# EAGLE design drum (EAGLE 7.7.0)
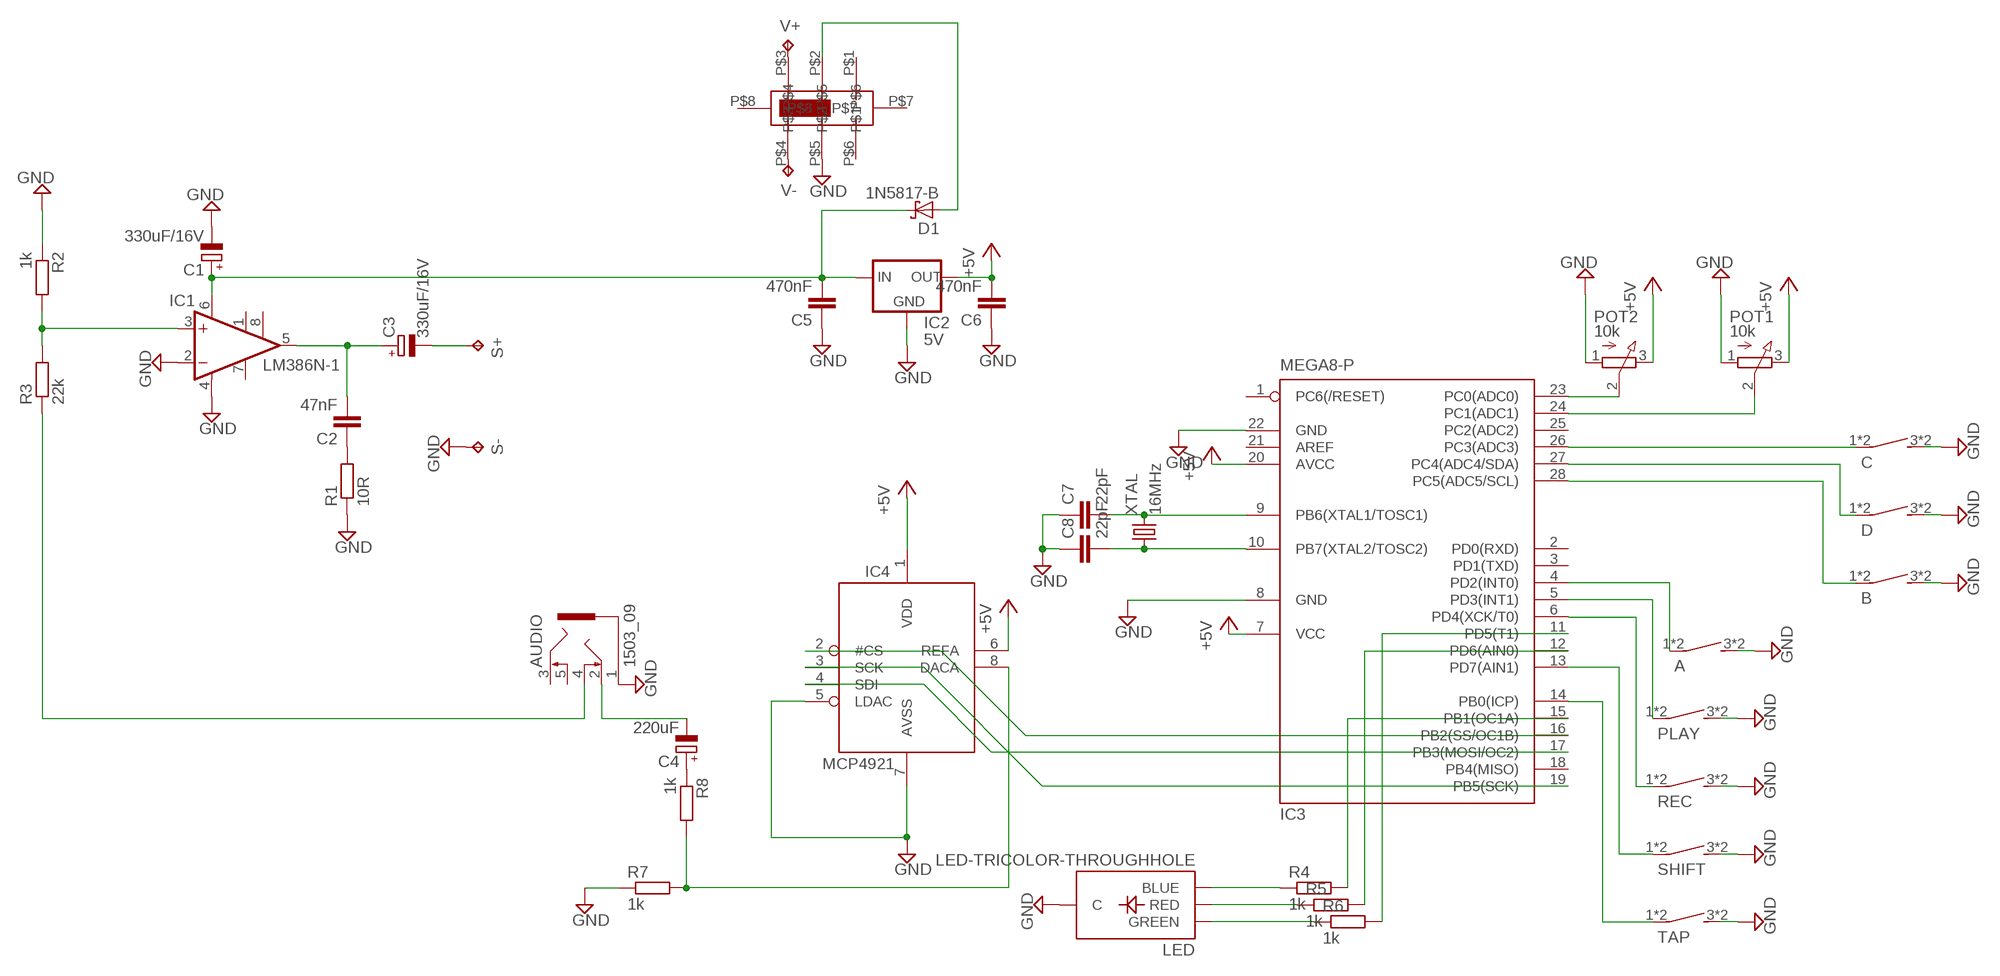
[diagram p0: schematic, sheet 1]

## Parts
A  D6R_SPSTB3F-4000  [B3F-4000]
AUDIO  1503_09  [1503_09]
B  D6R_SPSTB3F-4000  [B3F-4000]
C  D6R_SPSTB3F-4000  [B3F-4000]
C1  330uF/16V  CPOL-EUE3.5-8  [E3,5-8]
C2  47nF  C-EU050-024X044  [C050-024X044]
C3  330uF/16V  CPOL-EUE3.5-8  [E3,5-8]
C4  220uF  CPOL-EUE2.5-6  [E2,5-6]
C5  470nF  C-EU050-024X044  [C050-024X044]
C6  470nF  C-EU050-024X044  [C050-024X044]
C7  22pF  C-EU050-024X044  [C050-024X044]
C8  22pF  C-EU050-024X044  [C050-024X044]
D  D6R_SPSTB3F-4000  [B3F-4000]
D1  1N5817-B  [DO41-7.6]
IC1  LM386N-1  [DIL08]
IC2  5V  78LXX  [78LXX]
IC3  MEGA8-P  [DIL28-3]
IC4  MCP4921  [DIL08]
LED  LED-TRICOLOR-THROUGHHOLE  [LED-TRICOLOR-THROUGHHOLE]
PLAY  D6R_SPSTB3F-4000  [B3F-4000]
POT1  10k  RK09K11310KBF2J  [EVUFXJ]
POT2  10k  RK09K11310KBF2J  [EVUFXJ]
PWR  SLIDE_SW_DPDT  [SS008B02P22]
R1  10R  R-EU_0207/10  [0207/10]
R2  1k  R-EU_0207/10  [0207/10]
R3  22k  R-EU_0207/10  [0207/10]
R4  1k  R-EU_0207/10  [0207/10]
R5  1k  R-EU_0207/10  [0207/10]
R6  1k  R-EU_0207/10  [0207/10]
R7  1k  R-EU_0207/10  [0207/10]
R8  1k  R-EU_0207/10  [0207/10]
REC  D6R_SPSTB3F-4000  [B3F-4000]
S+  TPPAD1-17  [P1-17]
S-  TPPAD1-17  [P1-17]
SHIFT  D6R_SPSTB3F-4000  [B3F-4000]
TAP  D6R_SPSTB3F-4000  [B3F-4000]
V+  TPPAD1-17  [P1-17]
V-  TPPAD1-17  [P1-17]
XTAL  16MHz  CRYSTALHC49S  [HC49/S]

## Nets
+5V: C6.2 IC2.OUT IC3.7(VCC) IC3.20(AVCC) IC4.1(VDD) IC4.6(REFA) POT1.3(E) POT2.3(E)
GND: A.3(S) A.4(S) AUDIO.1 B.3(S) B.4(S) C1.- C5.1 C6.1 C7.1 C8.1 C.3(S) C.4(S) D.3(S) D.4(S) IC1.2(-IN) IC1.4(GND) IC2.GND IC3.8(GND) IC3.22(GND) IC4.5(LDAC) IC4.7(AVSS) LED.GND(C) PLAY.3(S) PLAY.4(S) POT1.1(A) POT2.1(A) PWR.P$5 R1.1 R2.1 R7.1 REC.3(S) REC.4(S) S-.TP SHIFT.3(S) SHIFT.4(S) TAP.3(S) TAP.4(S)
N$1: C2.1 R1.2
N$2: IC3.15(PB1(OC1A)) R4.2
N$3: IC3.12(PD6(AIN0)) R5.2
N$4: IC3.11(PD5(T1)) R6.2
N$5: IC3.5(PD3(INT1)) PLAY.1(P) PLAY.2(P)
N$6: C1.+ C5.2 D1.C IC1.6(VS) IC2.IN
N$7: IC3.17(PB3(MOSI/OC2)) IC4.4(SDI)
N$8: A.1(P) A.2(P) IC3.4(PD2(INT0))
N$9: IC3.19(PB5(SCK)) IC4.3(SCK)
N$10: IC3.23(PC0(ADC0)) POT2.2(S)
N$11: IC3.24(PC1(ADC1)) POT1.2(S)
N$12: C4.+ R8.1
N$13: IC4.8(DACA) R7.2 R8.2
N$14: LED.GRN(BLUE) R4.1
N$15: LED.BLU(RED) R5.1
N$16: LED.RED(GREEN) R6.1
N$17: C7.2 IC3.9(PB6(XTAL1/TOSC1)) XTAL.2
N$18: AUDIO.2 C4.-
N$19: D.1(P) D.2(P) IC3.27(PC4(ADC4/SDA))
N$20: C8.2 IC3.10(PB7(XTAL2/TOSC2)) XTAL.1
N$21: C2.2 C3.+ IC1.5(OUT)
N$22: C3.- S+.TP
N$23: IC1.3(+IN) R2.2 R3.2
N$24: AUDIO.4 R3.1
N$25: PWR.P$4 V-.TP
N$26: PWR.P$3 V+.TP
N$27: D1.A PWR.P$2
N$28: IC3.14(PB0(ICP)) TAP.1(P) TAP.2(P)
N$29: IC3.6(PD4(XCK/T0)) REC.1(P) REC.2(P)
N$31: IC3.13(PD7(AIN1)) SHIFT.1(P) SHIFT.2(P)
N$33: C.1(P) C.2(P) IC3.26(PC3(ADC3))
N$34: B.1(P) B.2(P) IC3.28(PC5(ADC5/SCL))
N$37: IC3.16(PB2(SS/OC1B)) IC4.2(#CS)
Unconnected: AUDIO.3 AUDIO.5 IC1.1(GAIN) IC1.7(BYPASS) IC1.8(GAIN) IC3.1(PC6(/RESET)) IC3.2(PD0(RXD)) IC3.3(PD1(TXD)) IC3.18(PB4(MISO)) IC3.21(AREF) IC3.25(PC2(ADC2)) PWR.P$1 PWR.P$6 PWR.P$7 PWR.P$8

## Library data of the parts
A B C D PLAY REC SHIFT TAP = adafruit:D6R_SPST: Judco 50-0015-00
AUDIO = con-lumberg:1503_09: Jack connectors according to JISC 6560, 3.5 mm Klinkeneinbaukupplung nach JISC 6560, 3,5 mm, 3-polig/ stereo, abgewinkelte Ausführung, mit 2 Öffnern und Lötaugen, für Leiterplatten Rückseitenmontage Source: http://www.lumberg.com/Produkte/PDFs/1503_09.pdf; OC_FARNELL: 1243244; OC_NEWARK: unknown
C1 C3 C4 = rcl:CPOL-EU: POLARIZED CAPACITOR, European symbol
C2 C5-C8 = resistor:C-EU: CAPACITOR, European symbol
D1 = diode:1N581*: 1.0A SCHOTTKY BARRIER RECTIFIER Source: http://www.diodes.com/datasheets/ds23001.pdf
IC1 = linear:LM386?-*: Low Voltage Audio Power Amplifier Source: http://cache.national.com/ds/LM/LM386.pdf
IC2 = v-reg:78LXX: VOLTAGE REGULATOR
IC3 = atmel:MEGA8-P: MICROCONTROLLER 8 Kbytes FLASH, 1 kbytes SRAM, 512 bytes EEPROM, USART, 4-channel 10 bit ADC, 2-channel 8 bit ADC Pin compatible with Atmega48, ATMega88, ATMega168 Source: avr.lbr; OC_FARNELL: unknown; OC_NEWARK: unknown
IC4 = adafruit:MCP4921
LED = SparkFun:LED-TRICOLOR-THROUGHHOLE
POT1 POT2 = blokas-labs:RK09K11310KB: 9 mm Square Rotary Potentiometers Source: Panasonic
PWR = blokas-labs:SLIDE_SW_DPDT
R1-R8 = resistor:R-EU_: RESISTOR, European symbol
S+ S- V+ V- = testpad:TP: Test pad
XTAL = crystal:CRYSTAL: CRYSTAL; OC_FARNELL: 1667008; OC_NEWARK: unknown

## Board
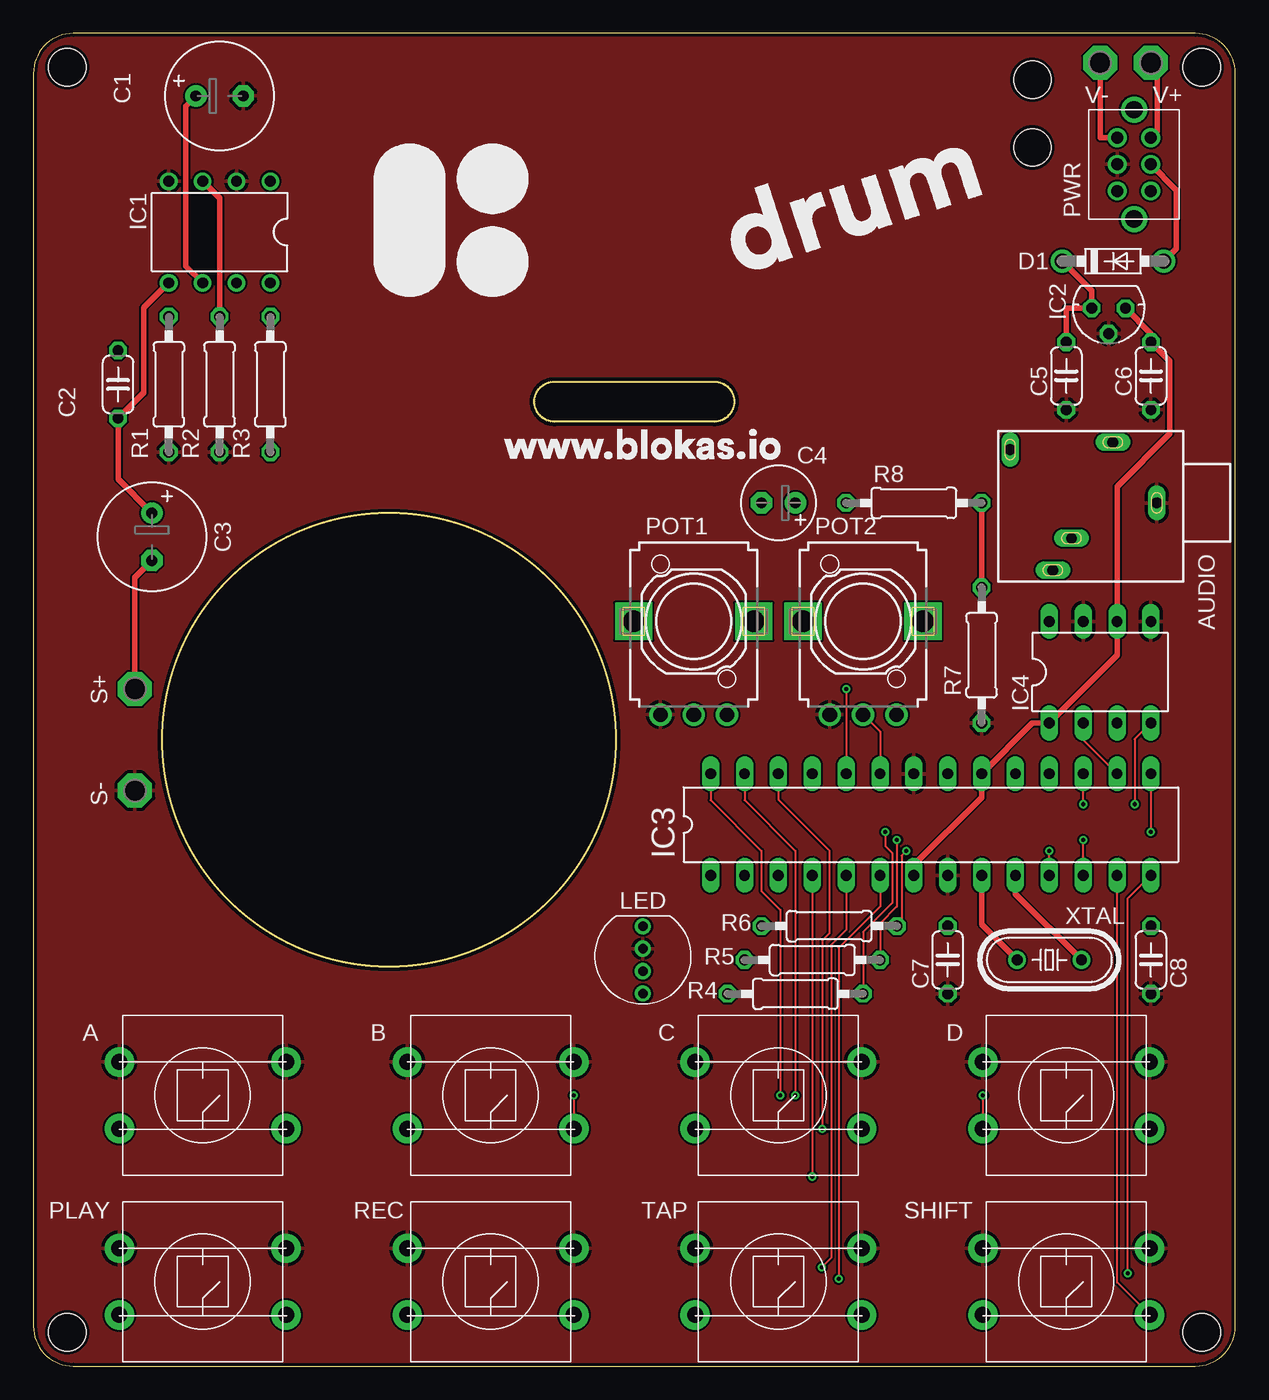
[diagram p1: board, top side]
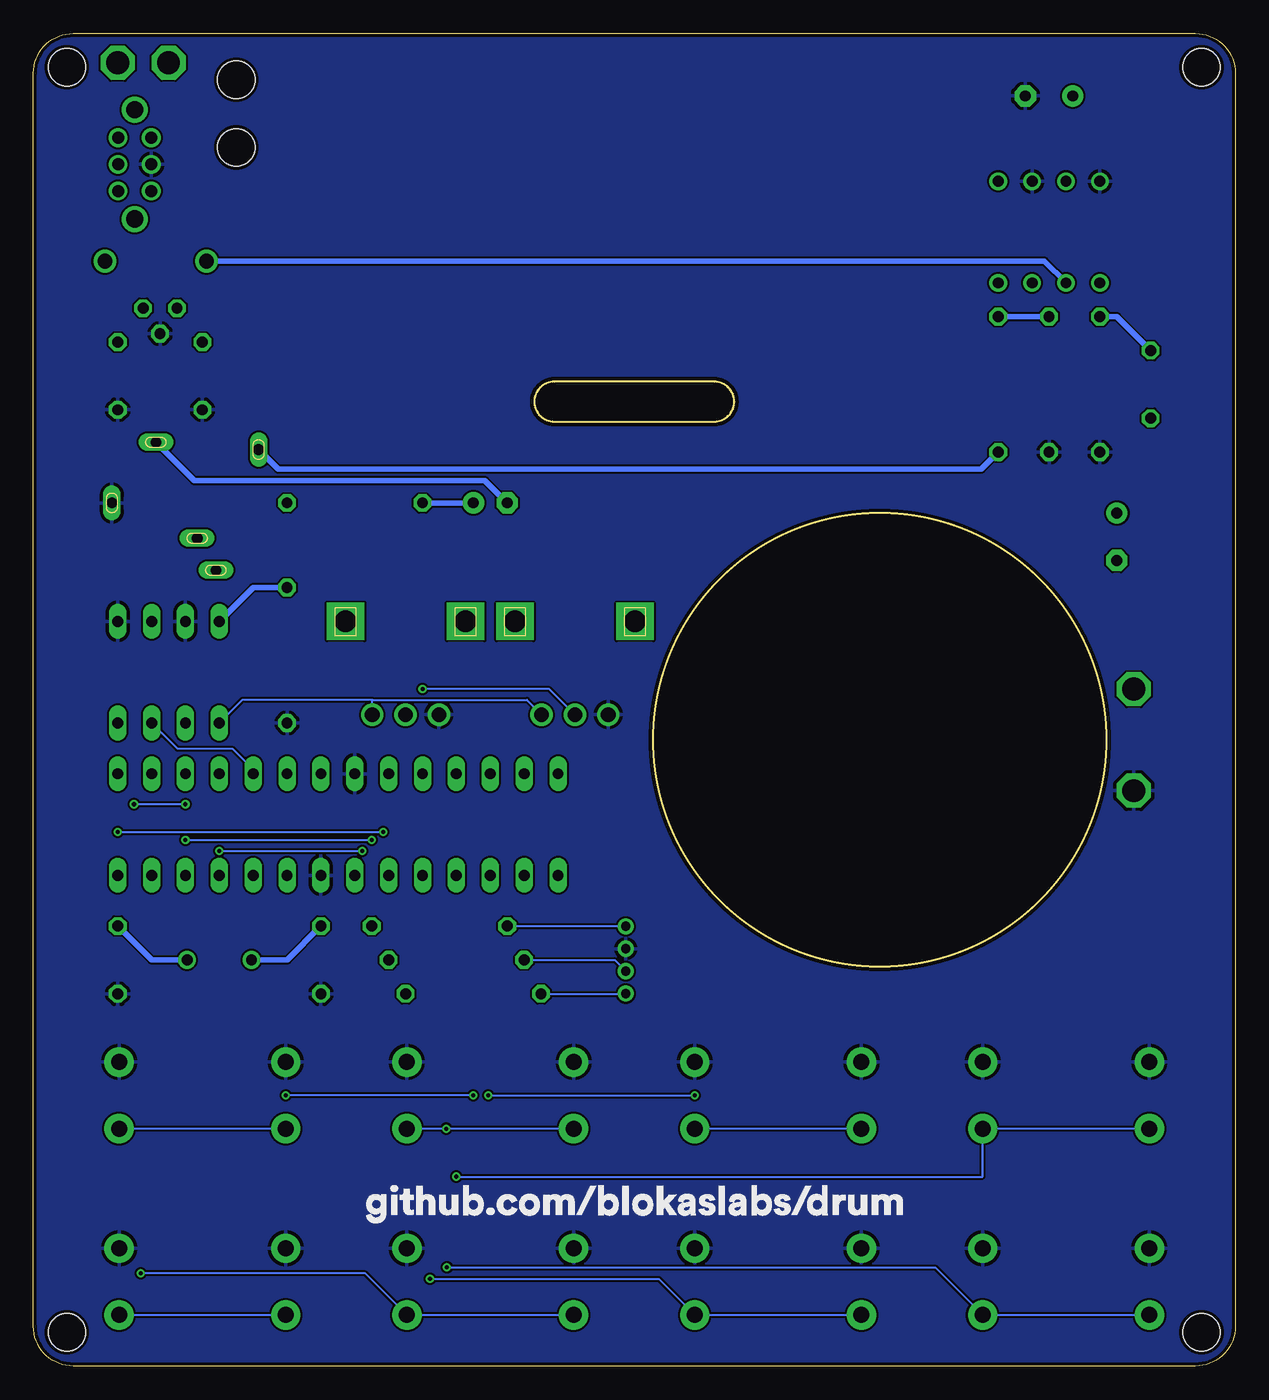
[diagram p2: board, bottom side, seen from below]

Size 90.15 x 100 mm. Coordinates in mm from the lower left corner, seen from the top.
Outline: 0,97 0,3 arc90 3,0 87.15,0 arc90 90.15,3 90.15,97 arc90 87.15,100 3,100 arc90 0,97
Outline: 51.08,70.86 39.08,70.86 arc-180 39.08,73.86 51.08,73.86 arc-180 51.08,70.86
Outline: circle at 26.67,46.99 radius 17
Copper layers (1*16): Top 0.035mm / dielectric 1.5mm / Bottom 0.035mm
Design rules "SeeedStudio_2layer_DRU_no_angle_20140221": minimum track width 6mil, minimum drill 12mil, track to track 6mil, track to pad 6mil, pad to pad 6mil, via to via 6mil, smd to smd 0mil, copper to edge 10mil, drill to drill 10mil, minimum pad ring 10mil, minimum via ring 6mil, stop-mask expansion 2mil, vias tented up to drill 100mil, thermal gap 10mil
Holes 2.8 mm at 2.54,2.54 87.63,2.54 2.54,97.46 87.63,97.46 74.93,96.52 74.93,91.44

### Footprints (pad centres in the part's own frame; a part is rotated, then mirrored left to right if it is on the bottom)
B3F-4000 = drill 1.2 pad 2.2: 1 6.25,-2.5; 2 -6.25,-2.5; 3 6.25,2.5; 4 -6.25,2.5
1503_09 = drill 0.8 pad 1.2 long: 1 0,-2.1; 2 -4.55,-5.4; 3 5.05,-9.9; 4 -4,-13.1; 5 2.65,-8.5
E3,5-8 = drill 0.813 pad 1.6: + -1.778,0 | drill 0.813 pad 1.6 octagon: - 1.778,0
C050-024X044 = drill 0.813 octagon: 1 -2.54,0; 2 2.54,0
E2,5-6 = drill 0.813 pad 1.6: + -1.27,0 | drill 0.813 pad 1.6 octagon: - 1.27,0
DO41-7.6 = drill 1.1 pad 1.7: A 3.81,0; C -3.81,0
DIL08 = drill 0.813 pad 1.27: 1 -3.81,-3.81; 2 -1.27,-3.81; 3 1.27,-3.81; 4 3.81,-3.81; 5 3.81,3.81; 6 1.27,3.81; 7 -1.27,3.81; 8 -3.81,3.81
78LXX = drill 0.813 octagon: GND 0,1.905; IN 1.27,0; OUT -1.27,0
DIL28-3 = drill 0.813 long: 1 -16.51,-3.81; 2 -13.97,-3.81; 3 -11.43,-3.81; 4 -8.89,-3.81; 5 -6.35,-3.81; 6 -3.81,-3.81; 7 -1.27,-3.81; 8 1.27,-3.81; 9 3.81,-3.81; 10 6.35,-3.81; 11 8.89,-3.81; 12 11.43,-3.81; 13 13.97,-3.81; 14 16.51,-3.81; 15 16.51,3.81; 16 13.97,3.81; 17 11.43,3.81; 18 8.89,3.81; 19 6.35,3.81; 20 3.81,3.81; 21 1.27,3.81; 22 -1.27,3.81; 23 -3.81,3.81; 24 -6.35,3.81; 25 -8.89,3.81; 26 -11.43,3.81; 27 -13.97,3.81; 28 -16.51,3.81
DIL08' = drill 0.813 long: 1 -3.81,-3.81; 2 -1.27,-3.81; 3 1.27,-3.81; 4 3.81,-3.81; 5 3.81,3.81; 6 1.27,3.81; 7 -1.27,3.81; 8 -3.81,3.81
LED-TRICOLOR-THROUGHHOLE = drill 0.7: BLU 0.841,0; GND -0.841,0; GRN 2.524,0; RED -2.524,0
EVUFXJ = drill 1.1 pad 1.676: 1 -2.5,-7; 2 0,-7; 3 2.5,-7 | drill 1.6 pad 2.8 square: M1 4.5,0; M2 -4.5,0
SS008B02P22 = drill 0.9: P$1 -2,-1.25; P$2 0,-1.25; P$3 2,-1.25; P$4 2,1.25; P$5 0,1.25; P$6 -2,1.25 | drill 1.3: P$7 -4.1,0; P$8 4.1,0
0207/10 = drill 0.813 octagon: 1 -5.08,0; 2 5.08,0
P1-17 = drill 1.702 pad 2.54 octagon: TP 0,0
HC49/S = drill 0.813: 1 -2.413,0; 2 2.413,0

### Placement (x,y rotation side)
A  12.7,20.32 0 top
AUDIO  86.36,64.77 270 top
B  34.29,20.32 0 top
C  55.88,20.32 0 top
C1  13.97,95.3 0 top
C2  6.35,73.66 270 top
C3  8.89,62.23 270 top
C4  55.88,64.77 180 top
C5  77.47,74.3 90 top
C6  83.82,74.3 90 top
C7  68.58,30.48 90 top
C8  83.82,30.48 90 top
D  77.47,20.32 0 top
D1  80.98,82.91 0 top
IC1  13.97,85.09 180 top
IC2  80.64,79.38 180 top
IC3  67.31,40.64 0 top
IC4  MCP4921  [DIL08']  80.01,52.07 0 top
LED  45.72,30.48 270 top
PLAY  12.7,6.35 0 top
POT1  49.53,55.88 0 top
POT2  62.23,55.88 0 top
PWR  82.55,90.17 90 top
R1  10.16,73.66 90 top
R2  13.97,73.66 90 top
R3  17.78,73.66 90 top
R4  57.15,27.94 0 top
R5  58.42,30.48 0 top
R6  59.69,33.02 0 top
R7  71.12,53.34 90 top
R8  66.04,64.77 0 top
REC  34.29,6.35 0 top
S+  7.62,50.8 0 top
S-  7.62,43.18 0 top
SHIFT  77.47,6.35 0 top
TAP  55.88,6.35 0 top
V+  83.82,97.79 0 top
V-  80.01,97.79 0 top
XTAL  76.2,30.48 180 top

### Tracks (layer width: path | path; a pad name or v marks a point on that pad's centre or on a via)
+5V
  Top 0.406: IC3.7 66.04,37.59 71.12,42.67 IC3.20 74.93,48.26 IC4.1 81.28,53.34 IC4.6 81.28,65.99 85.24,69.95 85.24,75.41 C6.2 83.82,77.47 IC2.OUT
  Bottom 0.152: POT2.3 64.73,49.99 | 64.73,49.99 53.14,49.99 POT1.3 | 64.73,49.99 74.47,49.99 IC4.1
GND
  pour Bottom: 0,97 0,3 arc90 3,0 87.15,0 arc90 90.15,3 90.15,97 arc90 87.15,100 3,100 arc90
  pour Top: 0,97 0,3 arc90 3,0 87.15,0 arc90 90.15,3 90.15,97 arc90 87.15,100 3,100 arc90
N$1
  Bottom 0.406: C2.1 8.89,78.74 R1.2
N$2  (via drill 0.3 pad 0.61)
  Top 0.152: IC3.15 v83.82,40.08 | v63.91,40.08 63.91,39.01 64.41,38.51 64.41,34.75 62.23,32.56 R4.2
  Bottom 0.152: v83.82,40.08 v63.91,40.08
N$3  (via drill 0.3 pad 0.61)
  Top 0.152: IC3.12 v78.74,39.47 | v64.77,39.47 64.77,34.49 63.5,33.22 R5.2
  Bottom 0.152: v78.74,39.47 v64.77,39.47
N$4  (via drill 0.3 pad 0.61)
  Top 0.152: IC3.11 v76.2,38.66 | v65.48,38.66 65.13,38.3 65.13,33.38 R6.2
  Bottom 0.152: v76.2,38.66 v65.48,38.66
N$5  (via drill 0.3 pad 0.61)
  Top 0.152: IC3.5 60.96,32.72 59.84,31.6 59.84,8.13 v59.13,7.42
  Bottom 0.152: PLAY.2 PLAY.1 22.52,7.42 v59.13,7.42
N$6
  Top 0.406: C1.+ 11.43,94.54 11.43,82.55 IC1.6 | C5.2 77.47,79.38 IC2.IN 79.38,80.7 D1.C
  Bottom 0.406: IC1.6 14.33,82.91 D1.C
N$7  (via drill 0.3 pad 0.61)
  Top 0.152: IC4.4 82.6,47.04 v82.6,42.16 | v78.74,42.16 IC3.17
  Bottom 0.152: v82.6,42.16 v78.74,42.16
N$8  (via drill 0.3 pad 0.61)
  Top 0.152: IC3.4 v58.42,14.22
  Bottom 0.152: A.2 A.1 18.95,14.22 v58.42,14.22
N$9
  Bottom 0.152: IC4.3 79.35,46.33 75.23,46.33 73.66,44.76 IC3.19
N$10
  Top 0.152: POT2.2 63.5,47.61 IC3.23
N$11  (via drill 0.3 pad 0.61)
  Top 0.152: v60.96,50.8 IC3.24
  Bottom 0.152: POT1.2 51.45,50.8 v60.96,50.8
N$12
  Bottom 0.406: R8.1 C4.+
N$13
  Top 0.406: R8.2 R7.2
  Bottom 0.406: IC4.8 73.66,58.42 R7.2
N$14
  Bottom 0.152: R4.1 45.74,27.94 LED.GRN
N$15
  Bottom 0.152: R5.1 46.56,30.48 LED.BLU
N$16
  Bottom 0.152: R6.1 45.74,33.02 LED.RED
N$17
  Top 0.406: IC3.9 71.12,33.15 XTAL.2
  Bottom 0.406: C7.2 71.12,30.48 XTAL.2
N$18
  Bottom 0.406: C4.- 56.29,66.45 78.09,66.45 AUDIO.2
N$19  (via drill 0.3 pad 0.61)
  Top 0.152: IC3.27 53.34,42.47 57.15,38.66 v57.15,20.32 | v71.22,20.32 D.2
  Bottom 0.152: D.2 D.1 | v57.15,20.32 v71.22,20.32
N$20
  Top 0.406: IC3.10 73.66,35.43 XTAL.1
  Bottom 0.406: C8.2 81.28,30.48 XTAL.1
N$21
  Top 0.406: IC1.5 8.28,79.4 8.28,73.05 C2.2 6.35,66.55 C3.+
N$22
  Top 0.406: C3.- 7.62,59.18 S+.TP
N$23
  Top 0.406: IC1.3 13.97,87.63 R2.2
  Bottom 0.406: R2.2 R3.2
N$24
  Bottom 0.406: AUDIO.4 71.8,67.31 19.05,67.31 R3.1
N$25
  Top 0.406: PWR.P$4 80.01,92.17 V-.TP
N$26
  Top 0.406: V+.TP 84.28,97.33 84.28,92.65 PWR.P$3
N$27
  Top 0.406: D1.A 85.72,83.84 85.72,88.25 PWR.P$2
N$28  (via drill 0.3 pad 0.61)
  Top 0.152: v82.09,6.96 82.09,35.1 IC3.14
  Bottom 0.152: v82.09,6.96 65.24,6.96 TAP.1 TAP.2
N$29  (via drill 0.3 pad 0.61)
  Top 0.152: IC3.6 63.5,34.49 60.4,31.39 v60.4,6.55
  Bottom 0.152: v60.4,6.55 43.24,6.55 REC.1 REC.2
N$31
  Top 0.152: SHIFT.1 81.28,6.29 IC3.13
  Bottom 0.152: SHIFT.1 SHIFT.2
N$33  (via drill 0.3 pad 0.61)
  Top 0.152: IC3.26 55.88,42.52 59.69,38.71 59.69,32.46 59.18,31.95 v59.18,17.82
  Bottom 0.152: C.2 v59.18,17.82 59.49,17.82 C.1
N$34  (via drill 0.3 pad 0.61)
  Top 0.152: IC3.28 50.8,42.47 54.61,38.66 54.61,35.66 56.03,34.24 v56.03,20.32 | v40.54,20.32 B.1
  Bottom 0.152: B.2 B.1 | v56.03,20.32 v40.54,20.32
N$37
  Top 0.152: IC4.2 78.74,46.99 IC3.16